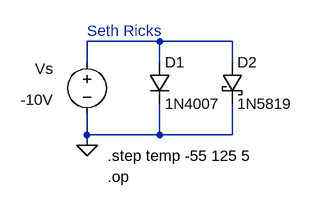
[diagram p0: schematic LTspice Diode Characteristics Lab.asc]
LTspice Diode Characteristics Lab.asc, the LTspice schematic file:
Version 4.1
SHEET 1 1072 680
WIRE 128 96 16 96
WIRE 240 96 128 96
WIRE 16 128 16 96
WIRE 128 128 128 96
WIRE 240 128 240 96
WIRE 16 240 16 208
WIRE 128 240 128 192
WIRE 128 240 16 240
WIRE 240 240 240 192
WIRE 240 240 128 240
WIRE 16 256 16 240
FLAG 16 256 0
SYMBOL voltage 16 112 R0
WINDOW 0 -80 26 Left 2
WINDOW 3 -102 74 Left 2
SYMATTR InstName Vs
SYMATTR Value -10V
SYMBOL schottky 224 128 R0
SYMATTR InstName D2
SYMATTR Value 1N5819
SYMATTR Description Diode
SYMATTR Type diode
SYMBOL diode 112 128 R0
SYMATTR InstName D1
SYMATTR Value 1N4007
TEXT 16 80 Left 2 ;Seth Ricks
TEXT 48 272 Left 2 !.step temp -55 125 5
TEXT 48 304 Left 2 !.op

The netlist it stands for:
* LTspice Diode Characteristics Lab.asc
Vs N001 0 -10V
D2 N001 0 1N5819
D1 N001 0 1N4007
.model D D
.lib standard.dio
* Seth Ricks
.step temp -55 125 5
.op
.backanno
.end